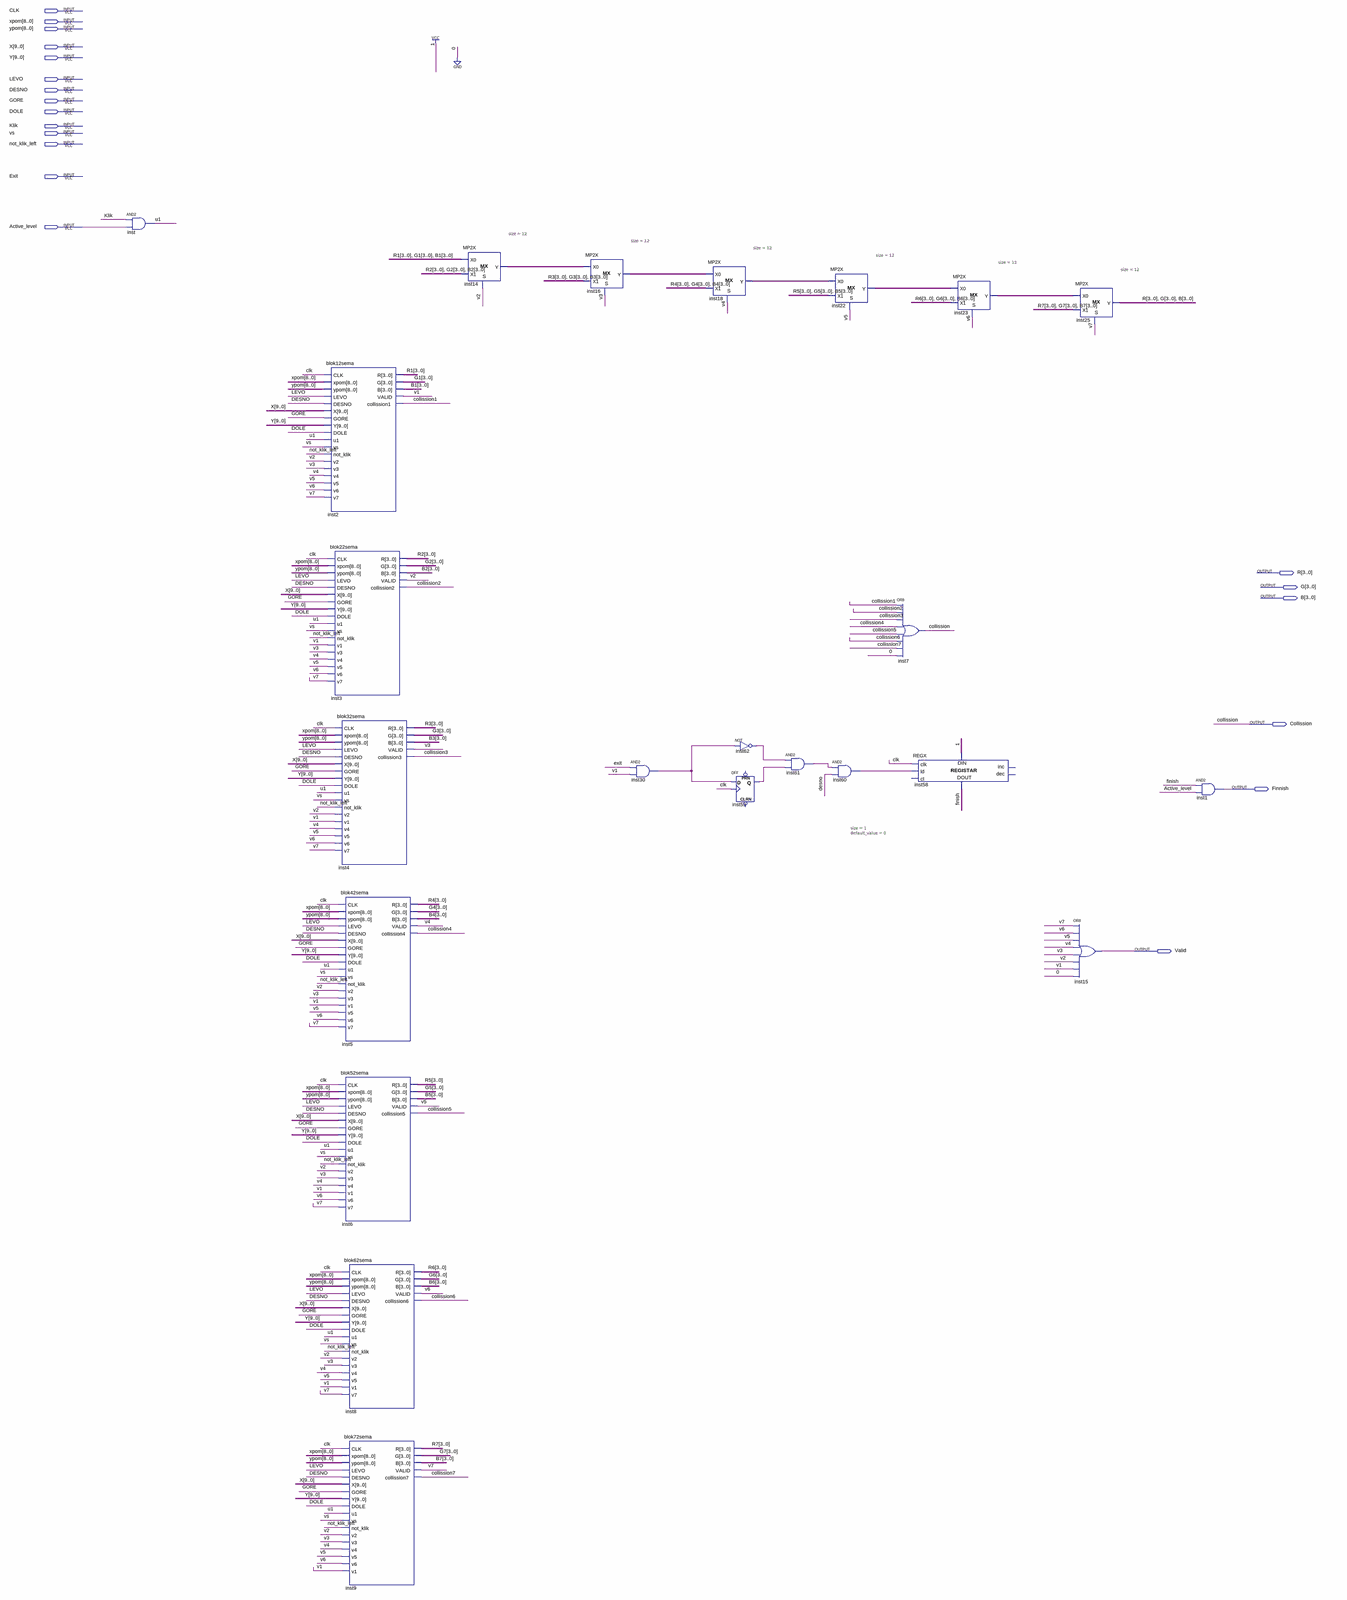
[diagram p0: schematic sheet, whole]
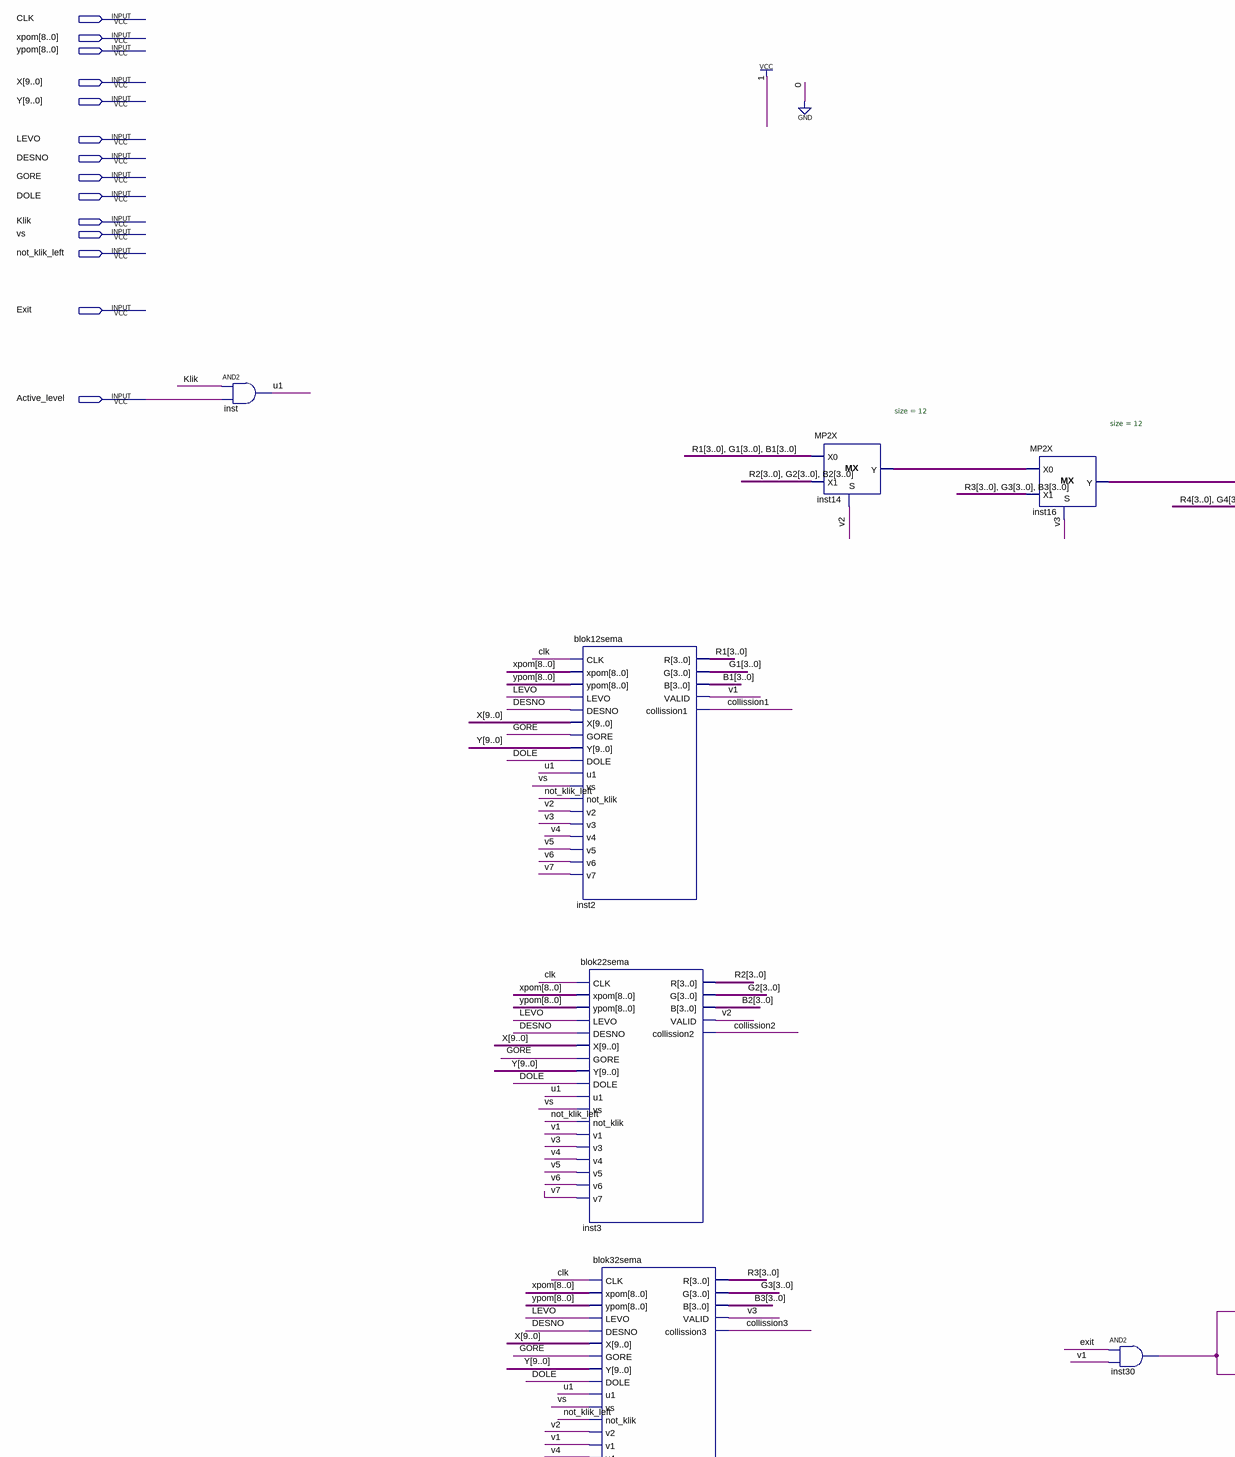
[diagram p1: schematic sheet, upper left part]
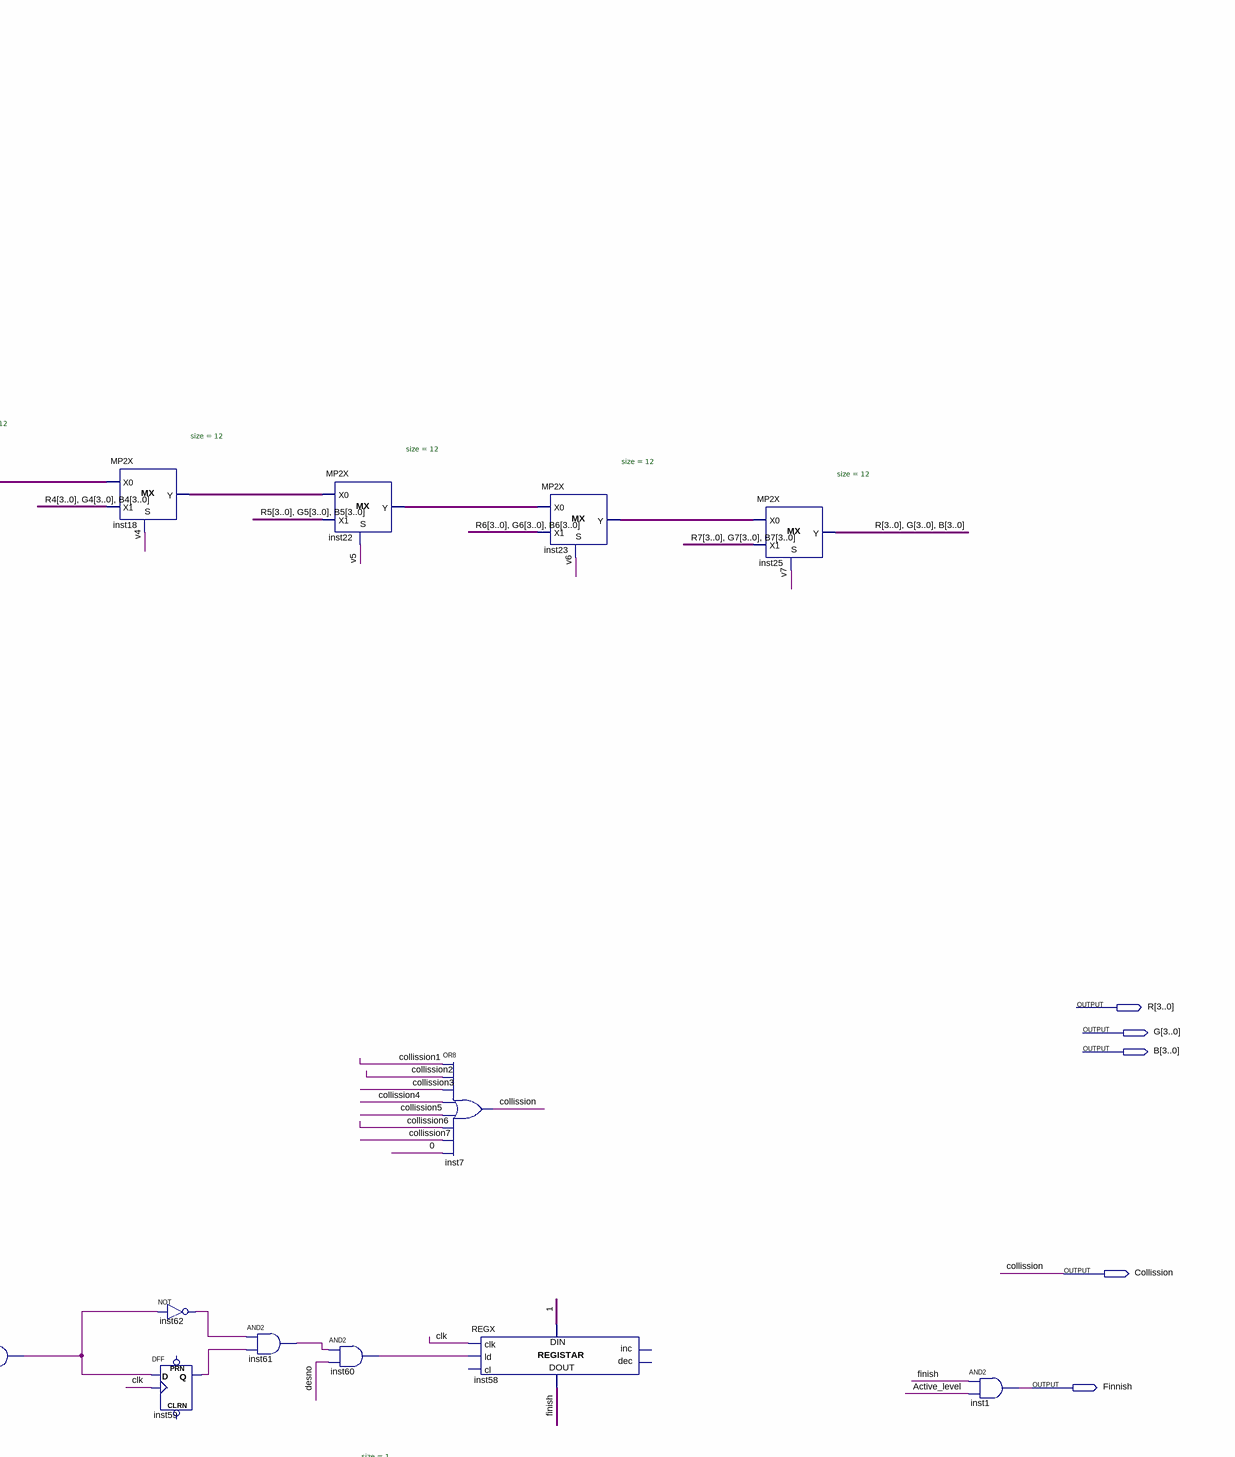
[diagram p2: schematic sheet, upper right part]
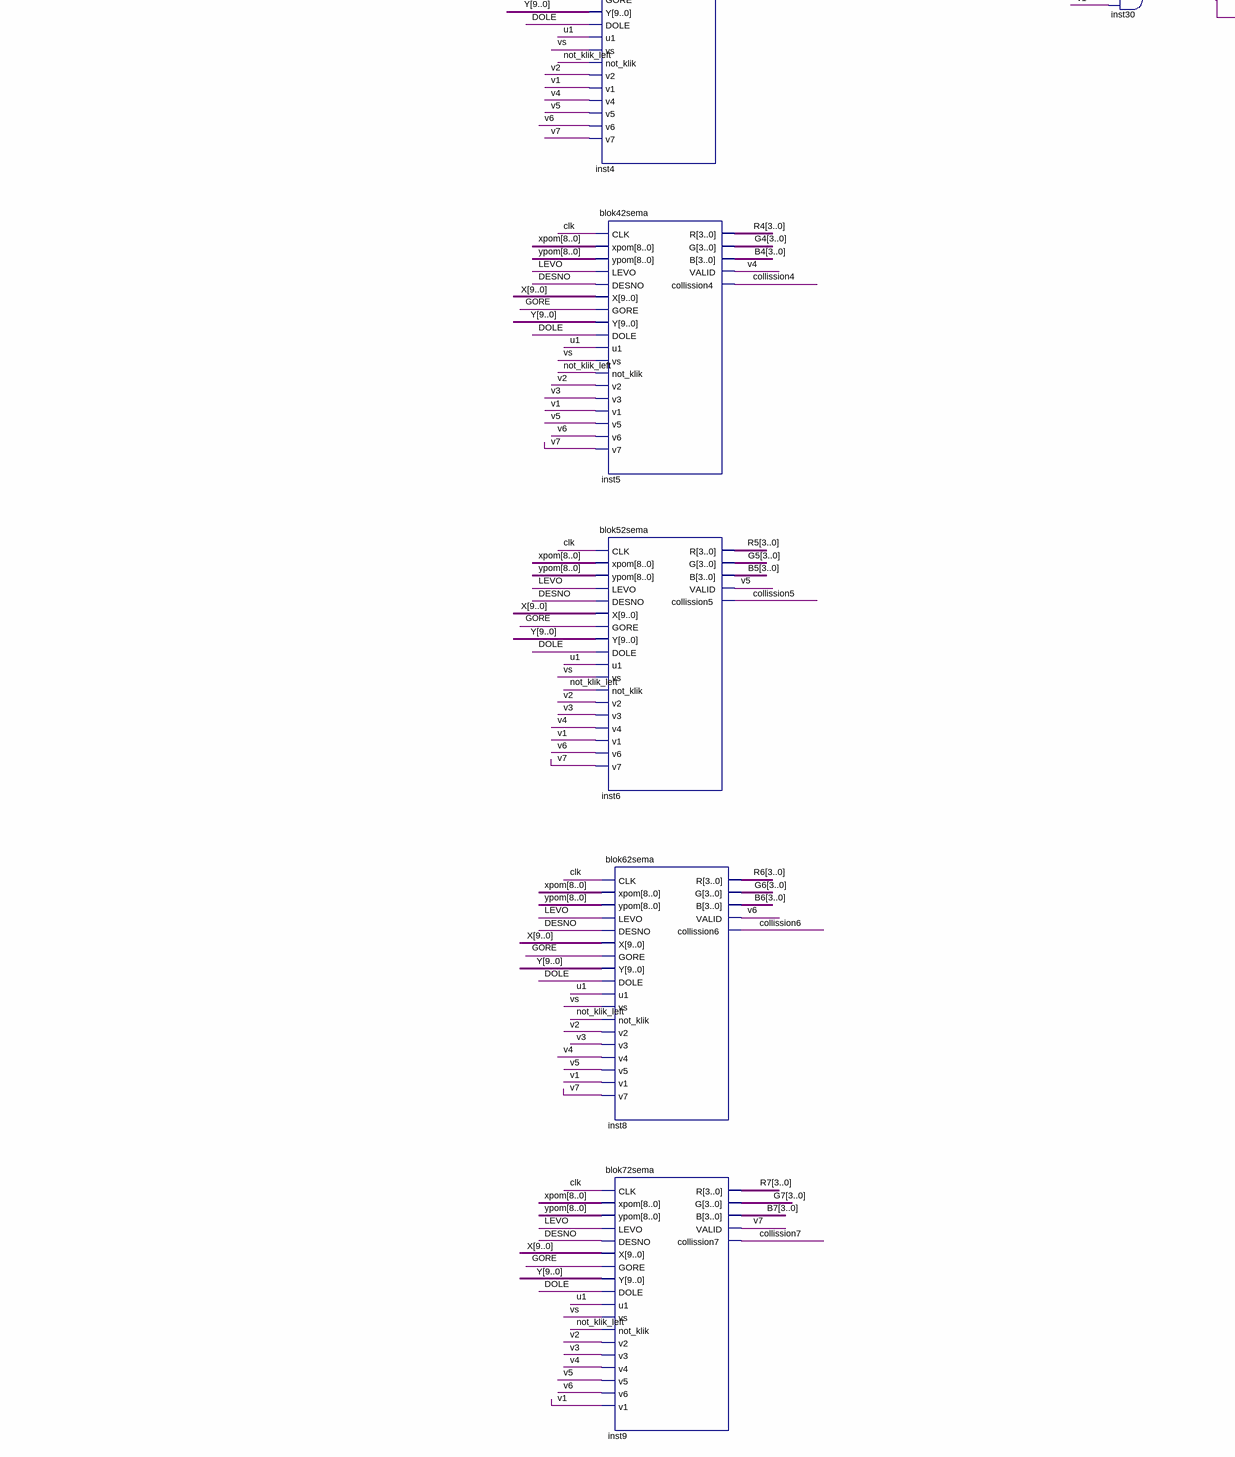
[diagram p3: schematic sheet, lower left part]
// Quartus schematic Level2.bdf as structural Verilog: 23 symbols, 20 pins
module Level2 (
  input  CLK,
  input  [8:0] xpom,
  input  [8:0] ypom,
  input  [9:0] X,
  input  [9:0] Y,
  input  LEVO,
  input  DESNO,
  input  GORE,
  input  DOLE,
  input  Klik,
  input  vs,
  input  not_klik_left,
  input  Exit,
  input  Active_level,
  output [3:0] R,
  output [3:0] G,
  output [3:0] B,
  output Collission,
  output Finnish,
  output Valid
);

  wire collission1, collission2, collission3, collission4, collission5, collission6, collission7, finish,
       inst30_out, inst59_q, inst60_out, inst61_out, inst62_out, u1, v1, v2, v3, v4, v5, v6, v7;
  wire [3:0] B1, B2, B3, B4, B5, B6, B7, G1, G2, G3, G4, G5, G6, G7, R1, R2, R3, R4, R5, R6, R7;
  wire [11:0] inst14_y, inst16_y, inst18_y, inst22_y, inst23_y;

  and inst (u1, Klik, Active_level);
  blok12sema inst2 (
    .CLK(CLK), .xpom(xpom), .ypom(ypom), .LEVO(LEVO), .DESNO(DESNO), .X(X), .GORE(GORE), .Y(Y), .DOLE(DOLE),
    .u1(u1), .vs(vs), .not_klik(not_klik_left), .v2(v2), .v3(v3), .v4(v4), .v5(v5), .v6(v6), .v7(v7), .R(R1),
    .G(G1), .B(B1), .VALID(v1), .collission1(collission1));
  blok22sema inst3 (
    .CLK(CLK), .xpom(xpom), .ypom(ypom), .LEVO(LEVO), .DESNO(DESNO), .X(X), .GORE(GORE), .Y(Y), .DOLE(DOLE),
    .u1(u1), .vs(vs), .not_klik(not_klik_left), .v1(v1), .v3(v3), .v4(v4), .v5(v5), .v6(v6), .v7(v7), .R(R2),
    .G(G2), .B(B2), .VALID(v2), .collission2(collission2));
  blok32sema inst4 (
    .CLK(CLK), .xpom(xpom), .ypom(ypom), .LEVO(LEVO), .DESNO(DESNO), .X(X), .GORE(GORE), .Y(Y), .DOLE(DOLE),
    .u1(u1), .vs(vs), .not_klik(not_klik_left), .v2(v2), .v1(v1), .v4(v4), .v5(v5), .v6(v6), .v7(v7), .R(R3),
    .G(G3), .B(B3), .VALID(v3), .collission3(collission3));
  blok42sema inst5 (
    .CLK(CLK), .xpom(xpom), .ypom(ypom), .LEVO(LEVO), .DESNO(DESNO), .X(X), .GORE(GORE), .Y(Y), .DOLE(DOLE),
    .u1(u1), .vs(vs), .not_klik(not_klik_left), .v2(v2), .v3(v3), .v1(v1), .v5(v5), .v6(v6), .v7(v7), .R(R4),
    .G(G4), .B(B4), .VALID(v4), .collission4(collission4));
  blok52sema inst6 (
    .CLK(CLK), .xpom(xpom), .ypom(ypom), .LEVO(LEVO), .DESNO(DESNO), .X(X), .GORE(GORE), .Y(Y), .DOLE(DOLE),
    .u1(u1), .vs(vs), .not_klik(not_klik_left), .v2(v2), .v3(v3), .v4(v4), .v1(v1), .v6(v6), .v7(v7), .R(R5),
    .G(G5), .B(B5), .VALID(v5), .collission5(collission5));
  blok62sema inst8 (
    .CLK(CLK), .xpom(xpom), .ypom(ypom), .LEVO(LEVO), .DESNO(DESNO), .X(X), .GORE(GORE), .Y(Y), .DOLE(DOLE),
    .u1(u1), .vs(vs), .not_klik(not_klik_left), .v2(v2), .v3(v3), .v4(v4), .v5(v5), .v1(v1), .v7(v7), .R(R6),
    .G(G6), .B(B6), .VALID(v6), .collission6(collission6));
  blok72sema inst9 (
    .CLK(CLK), .xpom(xpom), .ypom(ypom), .LEVO(LEVO), .DESNO(DESNO), .X(X), .GORE(GORE), .Y(Y), .DOLE(DOLE),
    .u1(u1), .vs(vs), .not_klik(not_klik_left), .v2(v2), .v3(v3), .v4(v4), .v5(v5), .v6(v6), .v1(v1), .R(R7),
    .G(G7), .B(B7), .VALID(v7), .collission7(collission7));
  MP2X #(.size(12)) inst14 (.S(v2), .X0({R1, G1, B1}), .X1({R2, G2, B2}), .Y(inst14_y));
  MP2X #(.size(12)) inst16 (.S(v3), .X0(inst14_y), .X1({R3, G3, B3}), .Y(inst16_y));
  and inst30 (inst30_out, Exit, v1);
  MP2X #(.size(12)) inst18 (.S(v4), .X0(inst16_y), .X1({R4, G4, B4}), .Y(inst18_y));
  DFF inst59 (.CLK(CLK), .D(inst30_out), .Q(inst59_q));  // open: CLRN, PRN
  not inst62 (inst62_out, inst30_out);
  and inst61 (inst61_out, inst62_out, inst59_q);
  MP2X #(.size(12)) inst22 (.S(v5), .X0(inst18_y), .X1({R5, G5, B5}), .Y(inst22_y));
  and inst60 (inst60_out, inst61_out, DESNO);
  or inst7 (Collission, collission1, collission2, collission3, collission4, collission5, collission6, collission7, 1'b0);
  REGX #(.size(1), .default_value(0)) inst58 (
    .clk(CLK), .ld(inst60_out), .data_in(1'b1), .data_out(finish));  // open: cl, inc, dec
  MP2X #(.size(12)) inst23 (.S(v6), .X0(inst22_y), .X1({R6, G6, B6}), .Y(inst23_y));
  MP2X #(.size(12)) inst25 (.S(v7), .X0(inst23_y), .X1({R7, G7, B7}), .Y({R, G, B}));
  or inst15 (Valid, v7, v6, v5, v4, v3, v2, v1, 1'b0);
  and inst1 (Finnish, finish, Active_level);
endmodule
